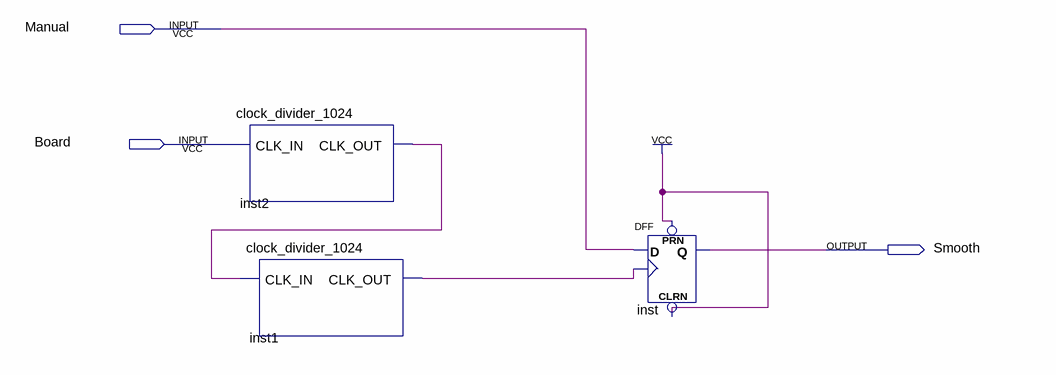
[diagram p0: schematic sheet]
// Quartus schematic debouncerSymbol.bdf as structural Verilog: 3 symbols, 3 pins
module debouncerSymbol (
  input  Manual,
  input  Board,
  output Smooth
);

  wire inst1_clk_out, inst2_clk_out;

  clock_divider_1024 inst2 (.CLK_IN(Board), .CLK_OUT(inst2_clk_out));
  clock_divider_1024 inst1 (.CLK_IN(inst2_clk_out), .CLK_OUT(inst1_clk_out));
  DFF inst (.CLRN(1'b1), .CLK(inst1_clk_out), .D(Manual), .PRN(1'b1), .Q(Smooth));
endmodule
